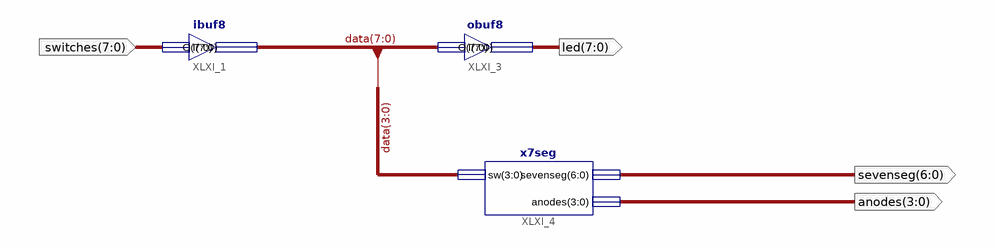
[diagram p0: schematic sheet 1]
// Xilinx ISE schematic toplevel.sch (spartan3e) as structural Verilog: 3 symbols, 4 ports
module toplevel (
  input  [7:0] switches,
  output [6:0] sevenseg,
  output [3:0] anodes,
  output [7:0] led
);

  wire [7:0] data;

  x7seg XLXI_4 (.sw(data[3:0]), .sevenseg(sevenseg), .anodes(anodes));
  ibuf8 XLXI_1 (.I(switches), .O(data));
  obuf8 XLXI_3 (.I(data), .O(led));
endmodule
